# EAGLE schematic artik530_carrierboard (EAGLE 9.0.0)

## Sheet 1 of 4
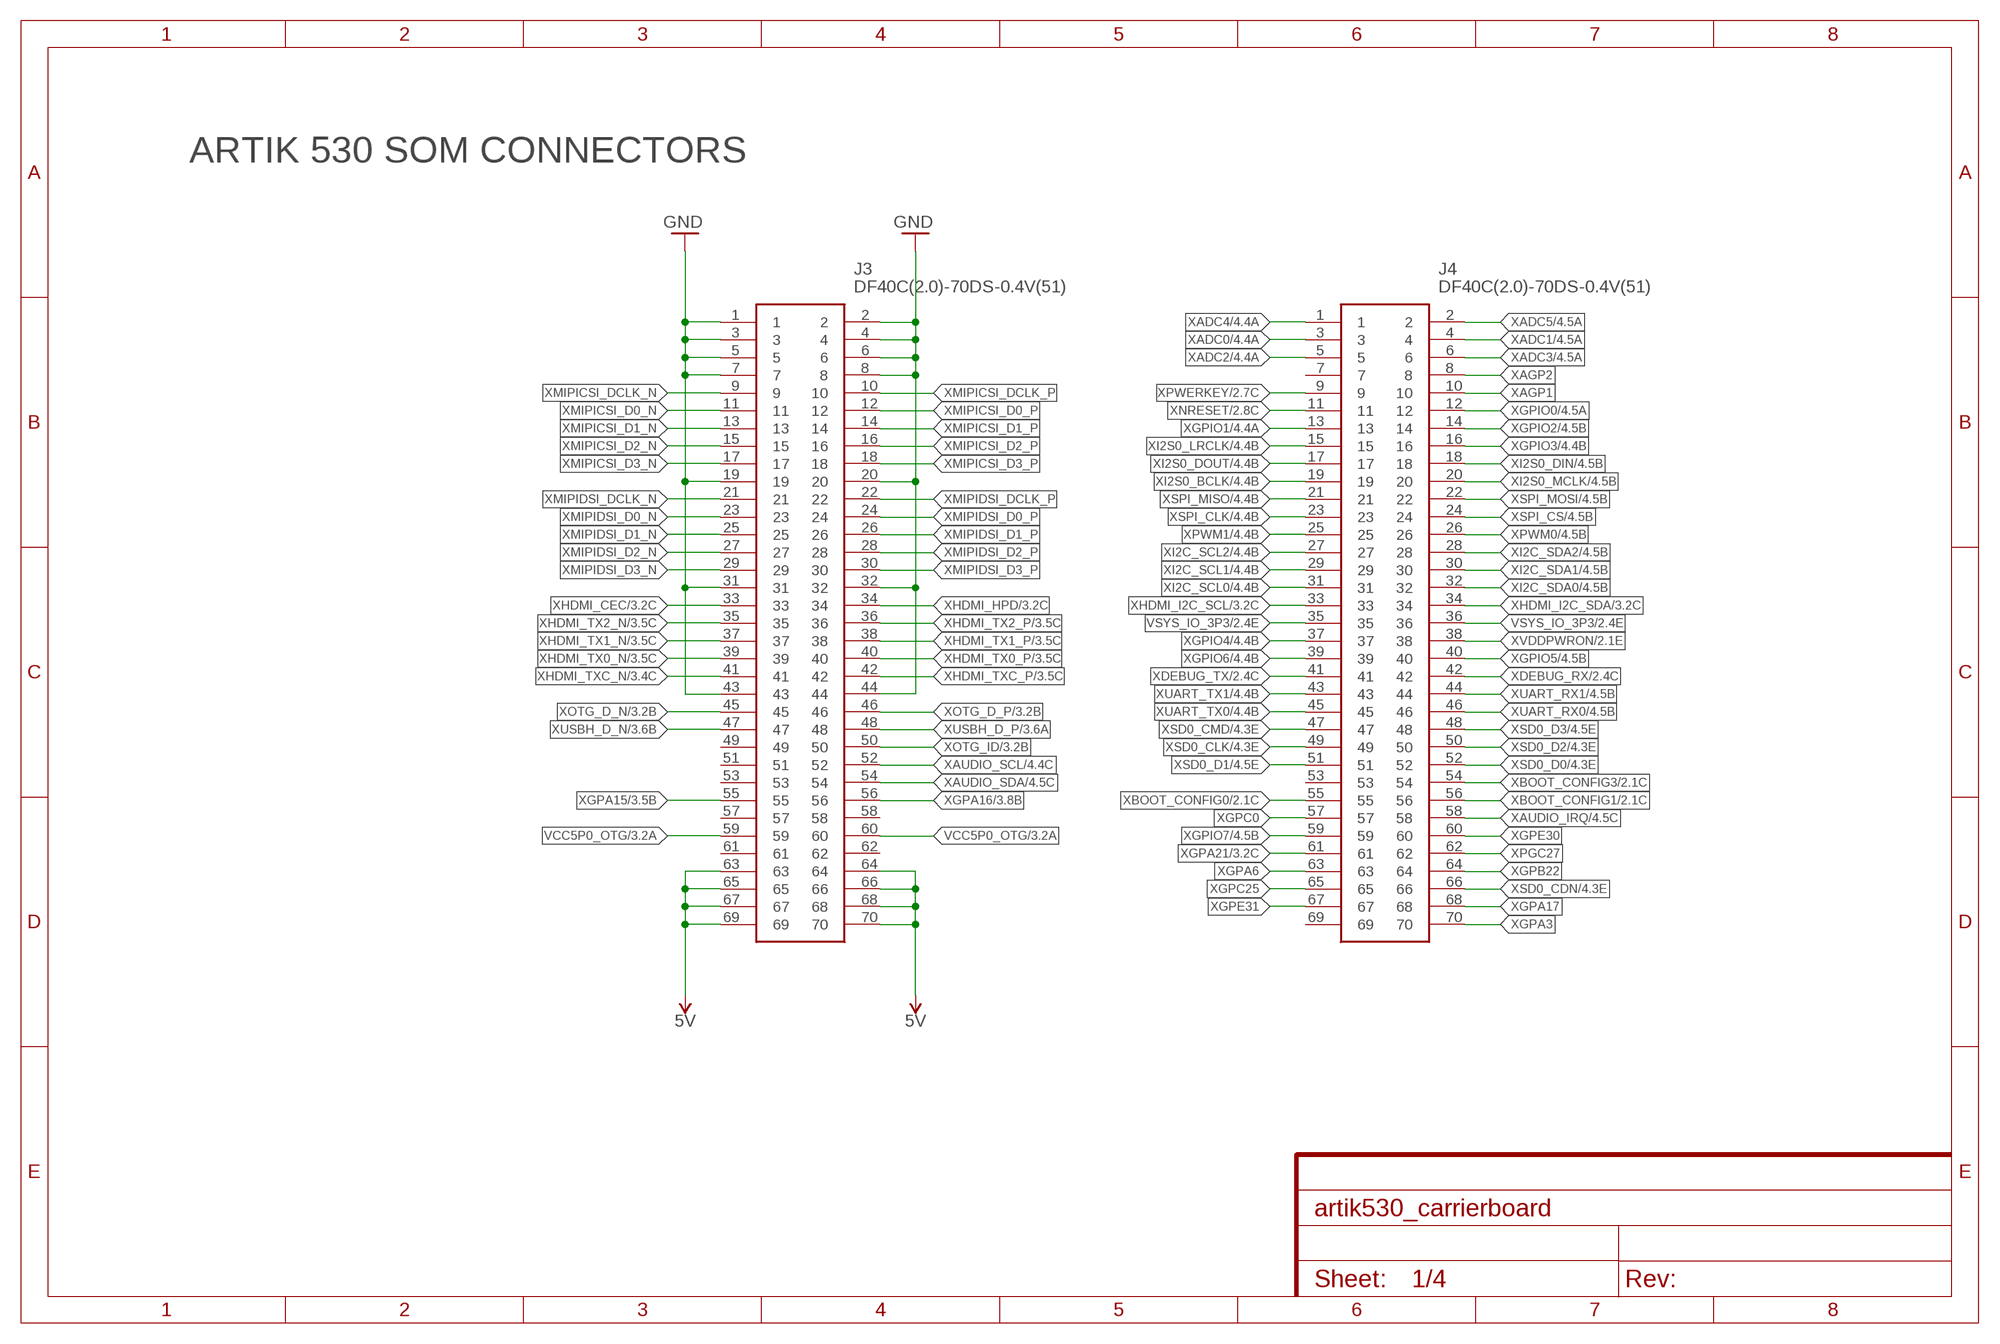
[diagram p0: schematic, sheet 1]

### Parts
J3  DF40C(2.0)-70DS-0.4V(51)  [DF40C(2.0)-70DS-0.4V(51)]
J4  DF40C(2.0)-70DS-0.4V(51)  [DF40C(2.0)-70DS-0.4V(51)]

### Nets
5V: J3.63 J3.64 J3.65 J3.66 J3.67 J3.68 J3.69 J3.70 ; also sheet 2,3,4
GND: J3.1 J3.2 J3.3 J3.4 J3.5 J3.6 J3.7 J3.8 J3.19 J3.20 J3.31 J3.32 J3.43 J3.44 ; also sheet 2,3,4
VCC5P0_OTG: J3.59 J3.60 ; also sheet 3
VSYS_IO_3P3: J4.35 J4.36 ; also sheet 2
XADC0: J4.3 ; also sheet 4
XADC1: J4.4 ; also sheet 4
XADC2: J4.5 ; also sheet 4
XADC3: J4.6 ; also sheet 4
XADC4: J4.1 ; also sheet 4
XADC5: J4.2 ; also sheet 4
XAGP1: J4.10
XAGP2: J4.8
XAUDIO_IRQ: J4.58 ; also sheet 4
XAUDIO_SCL: J3.52 ; also sheet 4
XAUDIO_SDA: J3.54 ; also sheet 4
XBOOT_CONFIG0: J4.55 ; also sheet 2
XBOOT_CONFIG1: J4.56 ; also sheet 2
XBOOT_CONFIG3: J4.54 ; also sheet 2
XDEBUG_RX: J4.42 ; also sheet 2
XDEBUG_TX: J4.41 ; also sheet 2
XGPA3: J4.70
XGPA6: J4.63
XGPA15: J3.55 ; also sheet 3
XGPA16: J3.56 ; also sheet 3
XGPA17: J4.68
XGPA21: J4.61 ; also sheet 3
XGPB22: J4.64
XGPC0: J4.57
XGPC25: J4.65
XGPE30: J4.60
XGPE31: J4.67
XGPIO0: J4.12 ; also sheet 4
XGPIO1: J4.13 ; also sheet 4
XGPIO2: J4.14 ; also sheet 4
XGPIO3: J4.16 ; also sheet 4
XGPIO4: J4.37 ; also sheet 4
XGPIO5: J4.40 ; also sheet 4
XGPIO6: J4.39 ; also sheet 4
XGPIO7: J4.59 ; also sheet 4
XHDMI_CEC: J3.33 ; also sheet 3
XHDMI_HPD: J3.34 ; also sheet 3
XHDMI_I2C_SCL: J4.33 ; also sheet 3
XHDMI_I2C_SDA: J4.34 ; also sheet 3
XHDMI_TX0_N: J3.39 ; also sheet 3
XHDMI_TX0_P: J3.40 ; also sheet 3
XHDMI_TX1_N: J3.37 ; also sheet 3
XHDMI_TX1_P: J3.38 ; also sheet 3
XHDMI_TX2_N: J3.35 ; also sheet 3
XHDMI_TX2_P: J3.36 ; also sheet 3
XHDMI_TXC_N: J3.41 ; also sheet 3
XHDMI_TXC_P: J3.42 ; also sheet 3
XI2C_SCL0: J4.31 ; also sheet 4
XI2C_SCL1: J4.29 ; also sheet 4
XI2C_SCL2: J4.27 ; also sheet 4
XI2C_SDA0: J4.32 ; also sheet 4
XI2C_SDA1: J4.30 ; also sheet 4
XI2C_SDA2: J4.28 ; also sheet 4
XI2S0_BCLK: J4.19 ; also sheet 4
XI2S0_DIN: J4.18 ; also sheet 4
XI2S0_DOUT: J4.17 ; also sheet 4
XI2S0_LRCLK: J4.15 ; also sheet 4
XI2S0_MCLK: J4.20 ; also sheet 4
XMIPICSI_D0_N: J3.11
XMIPICSI_D0_P: J3.12
XMIPICSI_D1_N: J3.13
XMIPICSI_D1_P: J3.14
XMIPICSI_D2_N: J3.15
XMIPICSI_D2_P: J3.16
XMIPICSI_D3_N: J3.17
XMIPICSI_D3_P: J3.18
XMIPICSI_DCLK_N: J3.9
XMIPICSI_DCLK_P: J3.10
XMIPIDSI_D0_N: J3.23
XMIPIDSI_D0_P: J3.24
XMIPIDSI_D1_N: J3.25
XMIPIDSI_D1_P: J3.26
XMIPIDSI_D2_N: J3.27
XMIPIDSI_D2_P: J3.28
XMIPIDSI_D3_N: J3.29
XMIPIDSI_D3_P: J3.30
XMIPIDSI_DCLK_N: J3.21
XMIPIDSI_DCLK_P: J3.22
XNRESET: J4.11 ; also sheet 2
XOTG_D_N: J3.45 ; also sheet 3
XOTG_D_P: J3.46 ; also sheet 3
XOTG_ID: J3.50 ; also sheet 3
XPGC27: J4.62
XPWERKEY: J4.9 ; also sheet 2
XPWM0: J4.26 ; also sheet 4
XPWM1: J4.25 ; also sheet 4
XSD0_CDN: J4.66 ; also sheet 4
XSD0_CLK: J4.49 ; also sheet 4
XSD0_CMD: J4.47 ; also sheet 4
XSD0_D0: J4.52 ; also sheet 4
XSD0_D1: J4.51 ; also sheet 4
XSD0_D2: J4.50 ; also sheet 4
XSD0_D3: J4.48 ; also sheet 4
XSPI_CLK: J4.23 ; also sheet 4
XSPI_CS: J4.24 ; also sheet 4
XSPI_MISO: J4.21 ; also sheet 4
XSPI_MOSI: J4.22 ; also sheet 4
XUART_RX0: J4.46 ; also sheet 4
XUART_RX1: J4.44 ; also sheet 4
XUART_TX0: J4.45 ; also sheet 4
XUART_TX1: J4.43 ; also sheet 4
XUSBH_D_N: J3.47 ; also sheet 3
XUSBH_D_P: J3.48 ; also sheet 3
XVDDPWRON: J4.38 ; also sheet 2
Unconnected: J3.49 J3.51 J3.53 J3.57 J3.58 J3.61 J3.62 J4.7 J4.53 J4.69

### Notes on the sheet
- ARTIK 530 SOM CONNECTORS

## Sheet 2 of 4
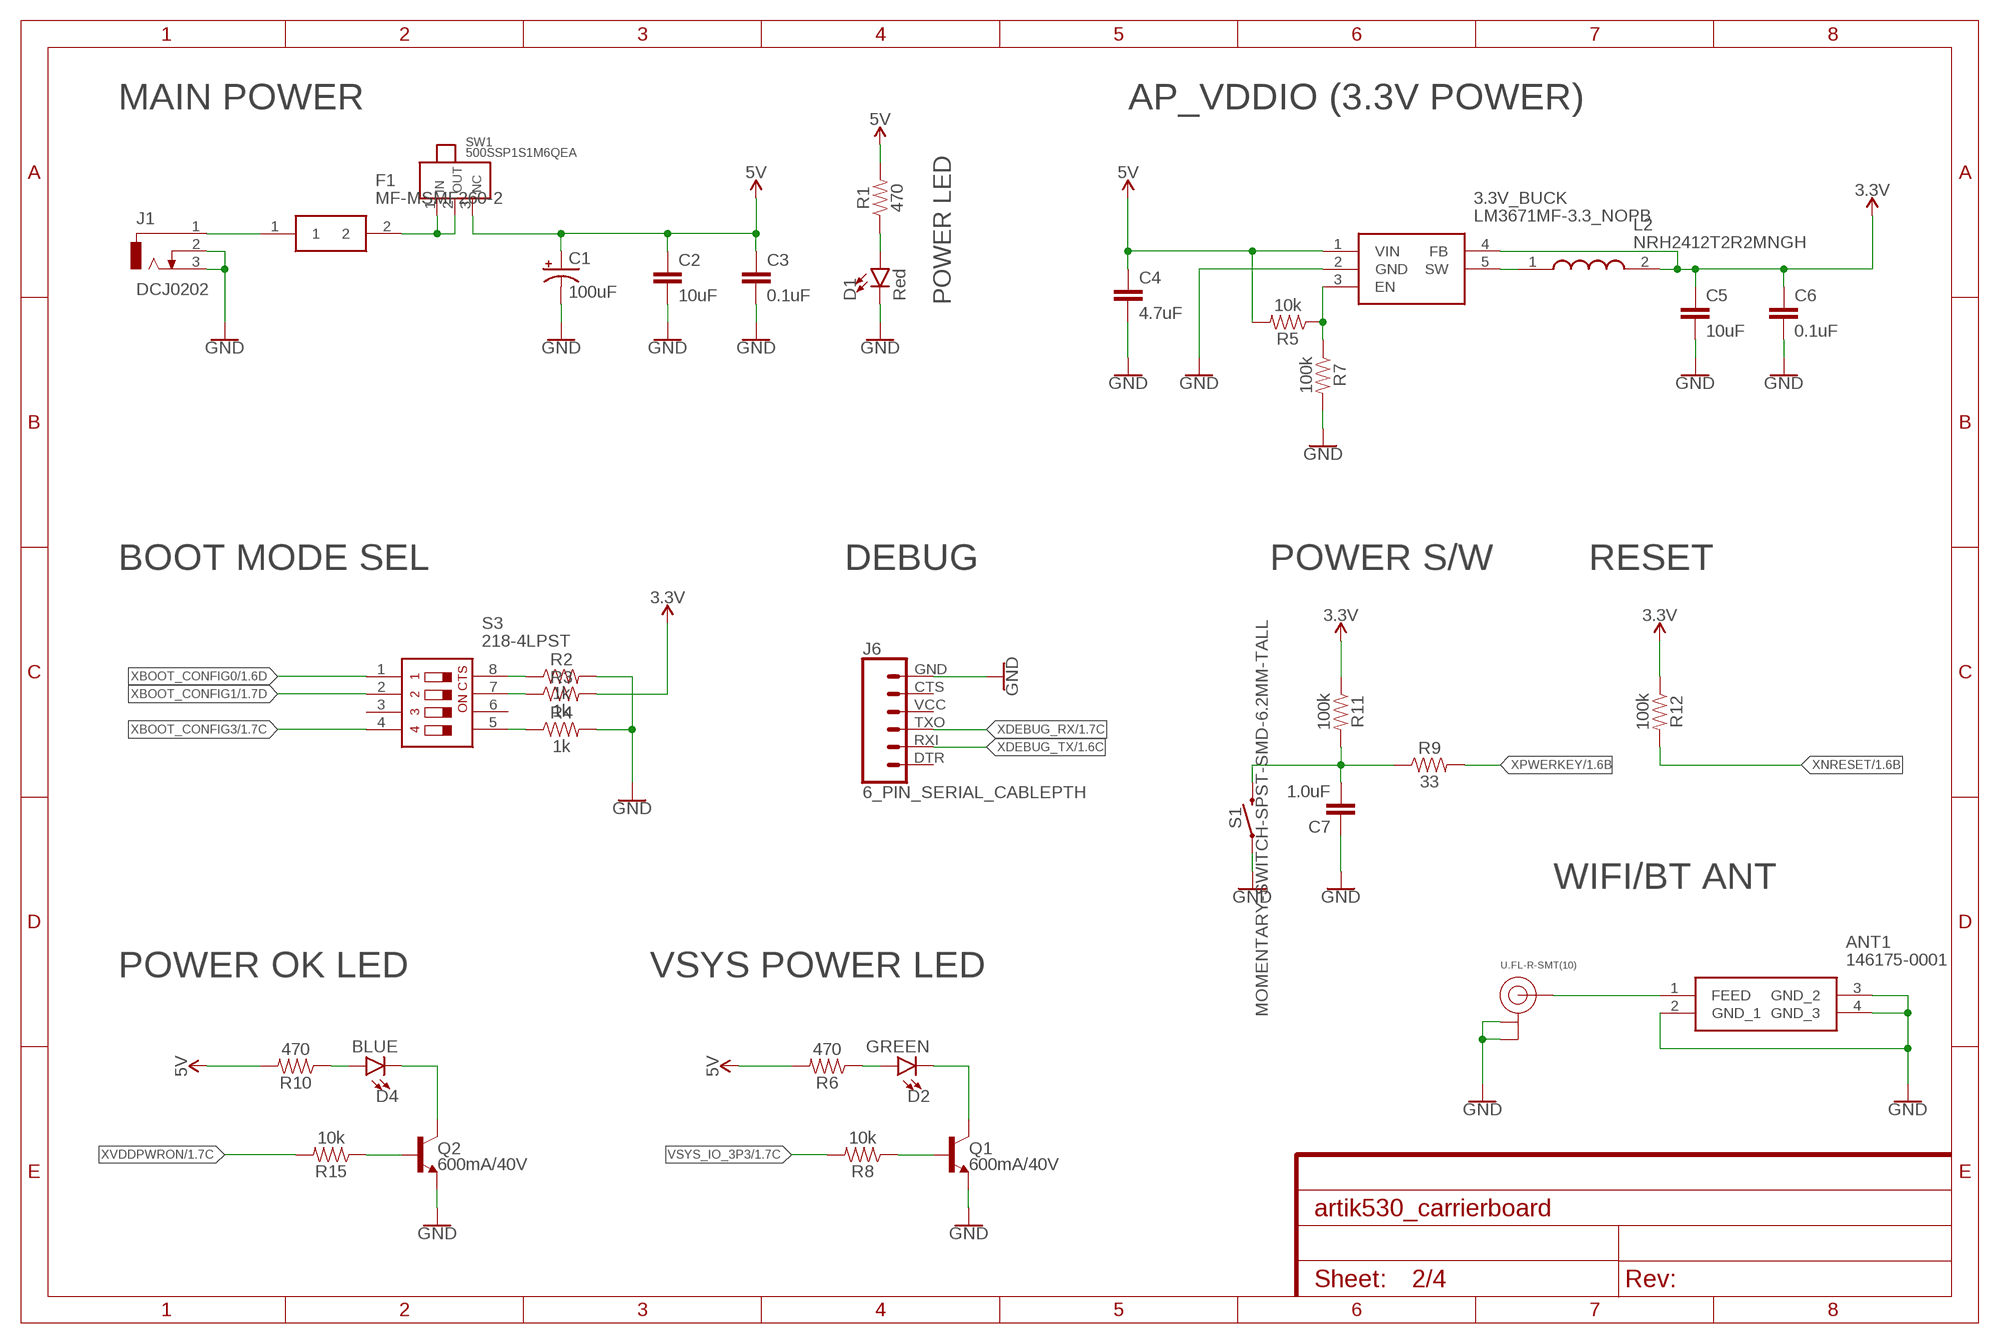
[diagram p1: schematic, sheet 2]

### Parts
3.3V_BUCK  LM3671MF-3.3_NOPB  [SOT95P284X122-5N]
ANT1  146175-0001  [146175-0001]
C1  100uF  100UF-POLAR-EIA7343-10V-10%(TANT)  [EIA7343]
C2  10uF  10UF-0603-6.3V-20%  [0603]
C3  0.1uF  0.1UF-0603-25V-(+80/-20%)  [0603]
C4  4.7uF  4.7UF-0603-6.3V-(10%)  [0603]
C5  10uF  10UF-0603-6.3V-20%  [0603]
C6  0.1uF  0.1UF-0603-25V-(+80/-20%)  [0603]
C7  1.0uF  1.0UF-0603-16V-10%  [0603]
D1  Red  LED-RED0603-SMART  [LED-0603]
D2  GREEN  LED-GREEN0603  [LED-0603]
D4  BLUE  LED-GREEN0603  [LED-0603]
F1  MF-MSMF260-2  [MF-MSMF260-2]
J1  DCJ0202  [DCJ0202]
J6  6_PIN_SERIAL_CABLEPTH  [FTDI_BASIC]
L2  NRH2412T2R2MNGH  [NRH2412T2R2MNGH]
Q1  600mA/40V  TRANS_NPN-MMBT2222AL  [SOT23-3]
Q2  600mA/40V  TRANS_NPN-MMBT2222AL  [SOT23-3]
R1  470  470OHM-0603-1/10W-1%  [0603]
R2  1k  1KOHM-0603-1/10W-1%  [0603]
R3  1k  1KOHM-0603-1/10W-1%  [0603]
R4  1k  1KOHM-0603-1/10W-1%  [0603]
R5  10k  10KOHM-0603-1/10W-1%  [0603]
R6  470  470OHM-0603-1/10W-1%  [0603]
R7  100k  100KOHM-0603-1/10W-1%  [0603]
R8  10k  10KOHM-0603-1/10W-1%  [0603]
R9  33  33OHM-0603-1/10W-1%  [0603]
R10  470  470OHM-0603-1/10W-1%  [0603]
R11  100k  100KOHM-0603-1/10W-1%  [0603]
R12  100k  100KOHM-0603-1/10W-1%  [0603]
R15  10k  10KOHM-0603-1/10W-1%  [0603]
S1  MOMENTARY-SWITCH-SPST-SMD-6.2MM-TALL  [TACTILE_SWITCH_SMD_6.2MM_TALL]
S3  218-4LPST  [SOIC127P844X265-8N]
SW1  500SSP1S1M6QEA  [500SSP1S1M6QEA]
U$3  U.FL-R-SMT(10)  [U.FL-R-SMT(10)]

### Nets
3.3V: 3.3V_BUCK.4(FB) C5.1 C6.1 L2.2 R3.2 R11.1 R12.1 ; also sheet 3,4
5V: 3.3V_BUCK.1(VIN) C1.A(+) C2.1 C3.1 C4.1 R1.2 R5.2 R6.2 R10.2 SW1.3(NC) ; also sheet 1,3,4
GND: 3.3V_BUCK.2(GND) ANT1.2(GND_1) ANT1.3(GND_2) ANT1.4(GND_3) C1.C(-) C2.2 C3.2 C4.2 C5.2 C6.2 C7.1 D1.C J1.2 J1.3 J6.GND Q1.2(E) Q2.2(E) R2.2 R4.2 R7.2 S1.A2 U$3.1(GND1) U$3.2(GND2) ; also sheet 1,3,4
N$1: F1.1 J1.1
N$2: F1.2 SW1.1(IN) SW1.2(OUT)
N$3: 3.3V_BUCK.5(SW) L2.1
N$4: D1.A R1.1
N$5: R2.1 S3.8
N$6: R3.1 S3.7
N$7: R4.1 S3.5
N$8: D2.A R6.1
N$9: 3.3V_BUCK.3(EN) R5.1 R7.1
N$10: D2.C Q1.3(C)
N$11: Q1.1(B) R8.1
N$12: C7.2 R9.1 R11.2 S1.B2
N$13: D4.A R10.1
N$20: D4.C Q2.3(C)
N$21: Q2.1(B) R15.1
N$32: ANT1.1(FEED) U$3.3(SIG)
VSYS_IO_3P3: R8.2 ; also sheet 1
XBOOT_CONFIG0: S3.1 ; also sheet 1
XBOOT_CONFIG1: S3.2 ; also sheet 1
XBOOT_CONFIG3: S3.4 ; also sheet 1
XDEBUG_RX: J6.TXO ; also sheet 1
XDEBUG_TX: J6.RXI ; also sheet 1
XNRESET: R12.2 ; also sheet 1
XPWERKEY: R9.2 ; also sheet 1
XVDDPWRON: R15.2 ; also sheet 1
Unconnected: J6.CTS J6.DTR J6.VCC S3.3 S3.6

### Notes on the sheet
- MAIN POWER | AP_VDDIO (3.3V POWER)
- POWER LED
- BOOT MODE SEL | DEBUG | POWER S/W | RESET
- WIFI/BT ANT
- POWER OK LED | VSYS POWER LED

## Sheet 3 of 4
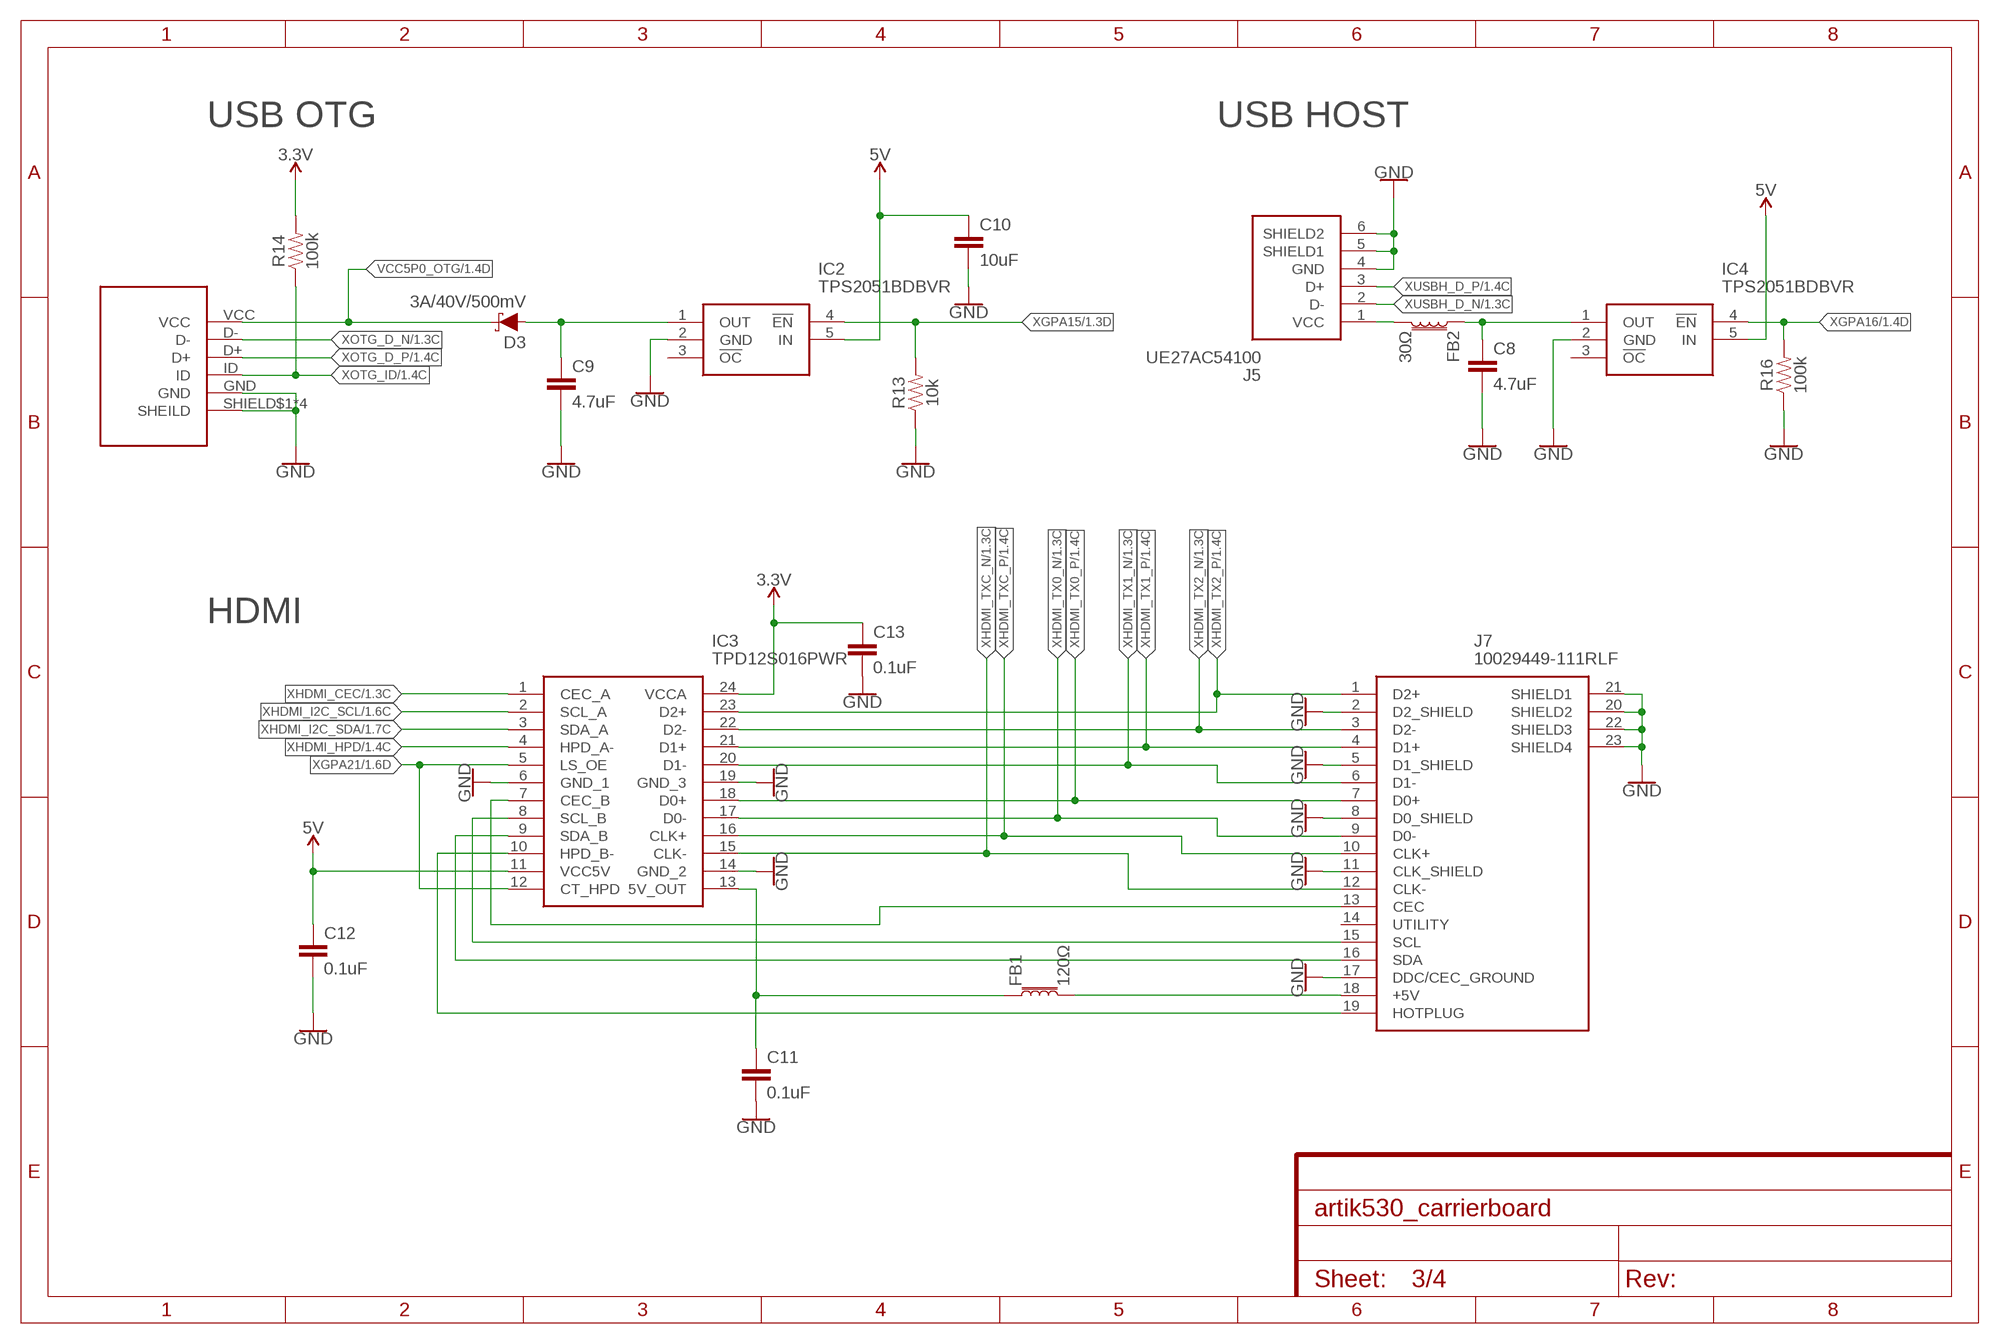
[diagram p2: schematic, sheet 3]

### Parts
C8  4.7uF  4.7UF-0603-6.3V-(10%)  [0603]
C9  4.7uF  4.7UF-0603-6.3V-(10%)  [0603]
C10  10uF  10UF-0603-6.3V-20%  [0603]
C11  0.1uF  0.1UF-0603-25V-(+80/-20%)  [0603]
C12  0.1uF  0.1UF-0603-25V-(+80/-20%)  [0603]
C13  0.1uF  0.1UF-0603-25V-(+80/-20%)  [0603]
D3  3A/40V/500mV  DIODE-SCHOTTKY-B340A  [SMA-DIODE]
FB1  120Ω  FERRITE_BEAD-0603  [0603]
FB2  30Ω  FERRITE_BEAD-0603  [0603]
IC2  TPS2051BDBVR  [SOT95P280X145-5N]
IC3  TPD12S016PWR  [SOP65P640X120-24N]
IC4  TPS2051BDBVR  [SOT95P280X145-5N]
J2  10118193-0001LF  [10118193-0001LF]
J5  UE27AC54100  [UE27AC54100]
J7  10029449-111RLF  [10029449-111RLF_1]
R13  10k  10KOHM-0603-1/10W-1%  [0603]
R14  100k  100KOHM-0603-1/10W-1%  [0603]
R16  100k  100KOHM-0603-1/10W-1%  [0603]

### Nets
3.3V: C13.1 IC3.24(VCCA) R14.2 ; also sheet 2,4
5V: C10.1 C12.1 IC2.5(IN) IC3.11(VCC5V) IC4.5(IN) ; also sheet 1,2,4
GND: C8.2 C9.2 C10.2 C11.2 C12.2 C13.2 IC2.2(GND) IC3.6(GND_1) IC3.14(GND_2) IC3.19(GND_3) IC4.2(GND) J2.GND J2.SHIELD$1(SHEILD) J2.SHIELD$2(SHEILD) J2.SHIELD$3(SHEILD) J2.SHIELD$4(SHEILD) J5.4(GND) J5.5(SHIELD1) J5.6(SHIELD2) J7.2(D2_SHIELD) J7.5(D1_SHIELD) J7.8(D0_SHIELD) J7.11(CLK_SHIELD) J7.17(DDC/CEC_GROUND) J7.20(SHIELD2) J7.21(SHIELD1) J7.22(SHIELD3) J7.23(SHIELD4) R13.1 R16.1 ; also sheet 1,2,4
N$14: C11.1 FB1.1 IC3.13(5V_OUT)
N$15: C9.1 D3.A IC2.1(OUT)
N$16: IC3.7(CEC_B) J7.13(CEC)
N$17: IC3.8(SCL_B) J7.15(SCL)
N$18: IC3.9(SDA_B) J7.16(SDA)
N$19: IC3.10(HPD_B-) J7.19(HOTPLUG)
N$22: FB1.2 J7.18(+5V)
N$23: C8.1 FB2.1 IC4.1(OUT)
N$24: FB2.2 J5.1(VCC)
VCC5P0_OTG: D3.C J2.VCC ; also sheet 1
XGPA15: IC2.4(!EN) R13.2 ; also sheet 1
XGPA16: IC4.4(!EN) R16.2 ; also sheet 1
XGPA21: IC3.5(LS_OE) IC3.12(CT_HPD) ; also sheet 1
XHDMI_CEC: IC3.1(CEC_A) ; also sheet 1
XHDMI_HPD: IC3.4(HPD_A-) ; also sheet 1
XHDMI_I2C_SCL: IC3.2(SCL_A) ; also sheet 1
XHDMI_I2C_SDA: IC3.3(SDA_A) ; also sheet 1
XHDMI_TX0_N: IC3.17(D0-) J7.9(D0-) ; also sheet 1
XHDMI_TX0_P: IC3.18(D0+) J7.7(D0+) ; also sheet 1
XHDMI_TX1_N: IC3.20(D1-) J7.6(D1-) ; also sheet 1
XHDMI_TX1_P: IC3.21(D1+) J7.4(D1+) ; also sheet 1
XHDMI_TX2_N: IC3.22(D2-) J7.3(D2-) ; also sheet 1
XHDMI_TX2_P: IC3.23(D2+) J7.1(D2+) ; also sheet 1
XHDMI_TXC_N: IC3.15(CLK-) J7.12(CLK-) ; also sheet 1
XHDMI_TXC_P: IC3.16(CLK+) J7.10(CLK+) ; also sheet 1
XOTG_D_N: J2.D- ; also sheet 1
XOTG_D_P: J2.D+ ; also sheet 1
XOTG_ID: J2.ID R14.1 ; also sheet 1
XUSBH_D_N: J5.2(D-) ; also sheet 1
XUSBH_D_P: J5.3(D+) ; also sheet 1
Unconnected: IC2.3(!OC) IC4.3(!OC) J7.14(UTILITY)

### Notes on the sheet
- USB OTG | USB HOST
- HDMI

## Sheet 4 of 4
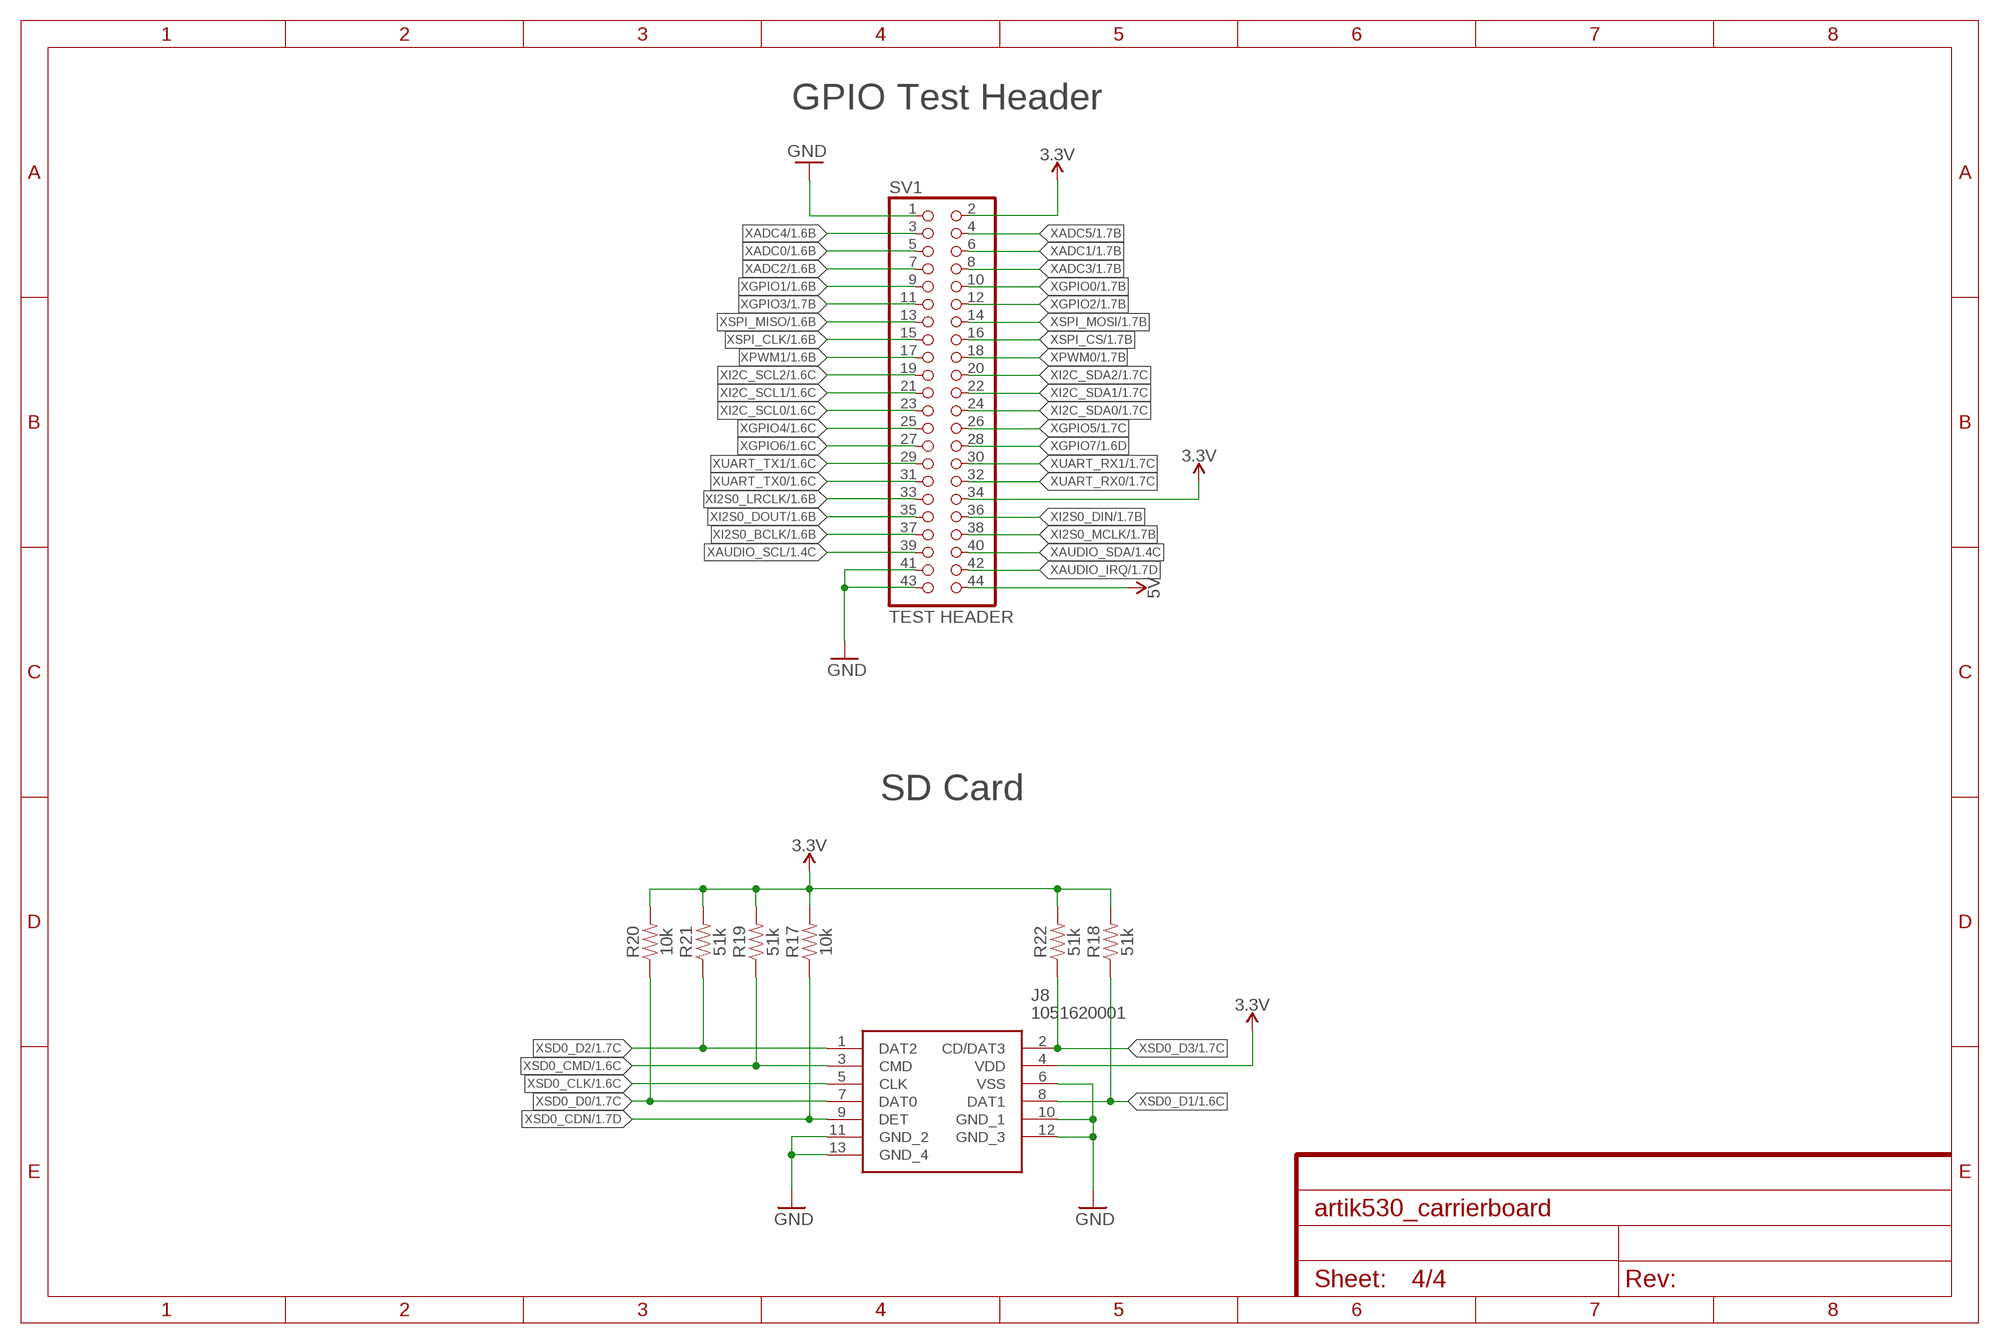
[diagram p3: schematic, sheet 4]

### Parts
J8  1051620001  [1051620001]
R17  10k  10KOHM-0603-1/10W-1%  [0603]
R18  51k  10KOHM-0603-1/10W-1%  [0603]
R19  51k  10KOHM-0603-1/10W-1%  [0603]
R20  10k  10KOHM-0603-1/10W-1%  [0603]
R21  51k  10KOHM-0603-1/10W-1%  [0603]
R22  51k  10KOHM-0603-1/10W-1%  [0603]
SV1  TEST HEADER  PINHD-2X22  [2X22]

### Nets
3.3V: J8.4(VDD) R17.2 R18.2 R19.2 R20.2 R21.2 R22.2 SV1.2 SV1.34 ; also sheet 2,3
5V: SV1.44 ; also sheet 1,2,3
GND: J8.6(VSS) J8.10(GND_1) J8.11(GND_2) J8.12(GND_3) J8.13(GND_4) SV1.1 SV1.41 SV1.43 ; also sheet 1,2,3
XADC0: SV1.5 ; also sheet 1
XADC1: SV1.6 ; also sheet 1
XADC2: SV1.7 ; also sheet 1
XADC3: SV1.8 ; also sheet 1
XADC4: SV1.3 ; also sheet 1
XADC5: SV1.4 ; also sheet 1
XAUDIO_IRQ: SV1.42 ; also sheet 1
XAUDIO_SCL: SV1.39 ; also sheet 1
XAUDIO_SDA: SV1.40 ; also sheet 1
XGPIO0: SV1.10 ; also sheet 1
XGPIO1: SV1.9 ; also sheet 1
XGPIO2: SV1.12 ; also sheet 1
XGPIO3: SV1.11 ; also sheet 1
XGPIO4: SV1.25 ; also sheet 1
XGPIO5: SV1.26 ; also sheet 1
XGPIO6: SV1.27 ; also sheet 1
XGPIO7: SV1.28 ; also sheet 1
XI2C_SCL0: SV1.23 ; also sheet 1
XI2C_SCL1: SV1.21 ; also sheet 1
XI2C_SCL2: SV1.19 ; also sheet 1
XI2C_SDA0: SV1.24 ; also sheet 1
XI2C_SDA1: SV1.22 ; also sheet 1
XI2C_SDA2: SV1.20 ; also sheet 1
XI2S0_BCLK: SV1.37 ; also sheet 1
XI2S0_DIN: SV1.36 ; also sheet 1
XI2S0_DOUT: SV1.35 ; also sheet 1
XI2S0_LRCLK: SV1.33 ; also sheet 1
XI2S0_MCLK: SV1.38 ; also sheet 1
XPWM0: SV1.18 ; also sheet 1
XPWM1: SV1.17 ; also sheet 1
XSD0_CDN: J8.9(DET) R17.1 ; also sheet 1
XSD0_CLK: J8.5(CLK) ; also sheet 1
XSD0_CMD: J8.3(CMD) R19.1 ; also sheet 1
XSD0_D0: J8.7(DAT0) R20.1 ; also sheet 1
XSD0_D1: J8.8(DAT1) R18.1 ; also sheet 1
XSD0_D2: J8.1(DAT2) R21.1 ; also sheet 1
XSD0_D3: J8.2(CD/DAT3) R22.1 ; also sheet 1
XSPI_CLK: SV1.15 ; also sheet 1
XSPI_CS: SV1.16 ; also sheet 1
XSPI_MISO: SV1.13 ; also sheet 1
XSPI_MOSI: SV1.14 ; also sheet 1
XUART_RX0: SV1.32 ; also sheet 1
XUART_RX1: SV1.30 ; also sheet 1
XUART_TX0: SV1.31 ; also sheet 1
XUART_TX1: SV1.29 ; also sheet 1

### Notes on the sheet
- GPIO Test Header
- SD Card

## Library data of the parts
3.3V_BUCK = LM3671MF-3.3_NOPB:LM3671MF-3.3_NOPB: DC-DC Converter Step-Dn 2.7-5.5V SOT23-5 Texas Instruments LM3671MF-3.3/NOPB, Step Down DC-DC Converter, 600mA, Adjustable, 1.1 3.3 V, 5-Pin SOT-23 Source: Datasheet <http://www.ti.com/lit/ds/symlink/lm3671.pdf>; DESCRIPTION: DC-DC Converter Step-Dn 2.7-5.5V SOT23-5 Texas Instruments LM3671MF-3.3/NOPB, Step Down DC-DC Converter, 600mA, Adjustable, 1.1 3.3 V, 5-Pin SOT-23; DIGIKEY_PART_NUMBER: LM3671MF-3.3/NOPBTR-ND; HEIGHT: 1.22mm; MANUFACTURER_NAME: Texas Instruments; MANUFACTURER_PART_NUMBER: LM3671MF-3.3/NOPB
ANT1 = 146175-0001:146175-0001: Antennas 2.4/5GHz SMTOnGround MID Chip Antenna Source: Datasheet <http://www.molex.com/webdocs/datasheets/pdf/en-us/1461750001_ANTENNAS.pdf>; ALLIED_NUMBER: 70904228; ALLIED_PRICE-STOCK: https://www.alliedelec.com/molex-incorporated-146175-0001/70904228/; ARROW_PART_NUMBER: 146175-0001; DESCRIPTION: Antennas 2.4/5GHz SMTOnGround MID Chip Antenna; HEIGHT: mm; MANUFACTURER_NAME: Molex; MANUFACTURER_PART_NUMBER: 146175-0001
C1 = SparkFun-Capacitors:100UF-POLAR: 100µF polarized capacitors A capacitor is a passive two-terminal electrical component used to store electrical energy temporarily in an electric field.; PROD_ID: CAP-07890
C2 C5 C10 = SparkFun-Capacitors:10UF: 10.0µF ceramic capacitors A capacitor is a passive two-terminal electrical component used to store electrical energy temporarily in an electric field.; PROD_ID: CAP-11015
C3 C6 C11-C13 = SparkFun-Capacitors:0.1UF: 0.1µF ceramic capacitors A capacitor is a passive two-terminal electrical component used to store electrical energy temporarily in an electric field.; PROD_ID: CAP-00810
C4 C8 C9 = SparkFun-Capacitors:4.7UF: 4.7µF ceramic capacitors A capacitor is a passive two-terminal electrical component used to store electrical energy temporarily in an electric field.; PROD_ID: CAP-08280
C7 = SparkFun-Capacitors:1.0UF: 1µF ceramic capacitors A capacitor is a passive two-terminal electrical component used to store electrical energy temporarily in an electric field.; PROD_ID: CAP-00868
D1 = SparkFun-LED:LED-RED: Red SMD LED Used in manufacturing of most products at SparkFun Packages: 0603 - SMD 0603 package [Product Link] <http://docs.avagotech.com/docs/AV02-0551EN> 0603 SMART - SMD 0603 SMART package ( more efficient and expensive)[Product Link] <http://www.osram-os.com/Graphics/XPic2/00077099_0.pdf> 1206 - SMD1206 package [Product Link] <https://www.sparkfun.com/datasheets/DevTools/LilyPad/Q150OVS4.pdff> SparkFun Products: Pro Mini 328 -5V <https://www.sparkfun.com/products/821> RedBoard <https://www.sparkfun.com/products/12757> IOIO-OTG <https://www.sparkfun.com/products/13613>; PROD_ID: DIO-11154
D2 = SparkFun-LED:LED-GREEN: Green SMD LED Used in manufacturing of various products at SparkFun Packages: 0603 - SMD 0603 package [Product Link] <http://www.futureelectronics.com/en/technologies/semiconductors/optoelectronics/leds/Pages/9894312-LTST-C190GKT.aspx?CrossPart=HSMG-C190&IM=0> LilyPad 1206 - SMD1206 LilyPad package [Product Link] <http://www.futureelectronics.com/en/Technologies/Product.aspx?ProductID=IN150NGHARVATEKCORPORATION2049943&IM=0> 1206 - SMD1206 package [Product Link] <http://www.futureelectronics.com/en/technologies/semiconductors/optoelectronics/leds/Pages/8315665-LTST-C150KGKT.aspx?IM=0> 1206 Bottom Mount -SMD 1206 Bottom Mount [Product Link] <http://www.digikey.com/product-detail/en/lite-on-inc/LTST-C230KGKT/160-1456-1-ND/386854> SparkFun Products: Pro Mini 328 -5V <https://www.sparkfun.com/products/821> RedBoard <https://www.sparkfun.com/products/12757> MP3 Trigger <https://www.sparkfun.com/products/13720> Makey Makey <https://www.sparkfun.com/products/11076>; PROD_ID: DIO-00821
D3 = SparkFun-DiscreteSemi:DIODE-SCHOTTKY: Schottky diode A Schottky diode is a semiconductor diode which has a low forward voltage drop and a very fast switching action.; PROD_ID: DIO-09886
D4 = SparkFun-LED:LED-GREEN: Green SMD LED Used in manufacturing of various products at SparkFun Packages: 0603 - SMD 0603 package [Product Link] <http://www.futureelectronics.com/en/technologies/semiconductors/optoelectronics/leds/Pages/9894312-LTST-C190GKT.aspx?CrossPart=HSMG-C190&IM=0> LilyPad 1206 - SMD1206 LilyPad package [Product Link] <http://www.futureelectronics.com/en/Technologies/Product.aspx?ProductID=IN150NGHARVATEKCORPORATION2049943&IM=0> 1206 - SMD1206 package [Product Link] <http://www.futureelectronics.com/en/technologies/semiconductors/optoelectronics/leds/Pages/8315665-LTST-C150KGKT.aspx?IM=0> 1206 Bottom Mount -SMD 1206 Bottom Mount [Product Link] <http://www.digikey.com/product-detail/en/lite-on-inc/LTST-C230KGKT/160-1456-1-ND/386854> SparkFun Products: Pro Mini 328 -5V <https://www.sparkfun.com/products/821> RedBoard <https://www.sparkfun.com/products/12757> MP3 Trigger <https://www.sparkfun.com/products/13720> Makey Makey <https://www.sparkfun.com/products/11076>; PROD_ID: DIO-00821; VALUE: GREEN
F1 = MF-MSMF260-2:MF-MSMF260-2: Fuse, PTC, Resettable, SMD, 1812, 2.6A Bourns 2.6A Surface Mount Resettable Fuse, 6 V Source: Datasheet <http://uk.rs-online.com/web/p/products/6478257>; ALLIED_NUMBER: 70153472; ALLIED_PRICE-STOCK: http://www.alliedelec.com/bourns-mf-msmf260-2/70153472/; ARROW_PART_NUMBER: MF-MSMF260-2; ARROW_PRICE-STOCK: https://www.arrow.com/en/products/mf-msmf260-2/bourns; DESCRIPTION: Fuse, PTC, Resettable, SMD, 1812, 2.6A Bourns 2.6A Surface Mount Resettable Fuse, 6 V; HEIGHT: mm; MANUFACTURER_NAME: Bourns; MANUFACTURER_PART_NUMBER: MF-MSMF260-2; RS_PART_NUMBER: 6478257P; RS_PRICE-STOCK: http://uk.rs-online.com/web/p/products/6478257P
FB1 FB2 = SparkFun-Coils:FERRITE_BEAD: Ferrite Bead (blocks, cores, rings, chokes, etc.) Inductor with layers of ferrite used to suppress high frequencies. Often used to isolate high frequency noise. SparkFun Products: IOIO-OTG - V2.2 <https://www.sparkfun.com/products/13613> SparkFun SAMD21 Mini Breakout <https://www.sparkfun.com/products/13664> SparkFun 6 Degrees of Freedom Breakout - LSM6DS3 <https://www.sparkfun.com/products/13339> SparkFun SAMD21 Dev Breakout <https://www.sparkfun.com/products/13672>; PROD_ID: NDUC-13805; VALUE: 30Ω/1.8A
IC2 IC4 = TPS2051BDBVR:TPS2051BDBVR: TEXAS INSTRUMENTS - TPS2051BDBVR - CURRENT LIMITED POWER SWITCH, 5.5V SOT23-5, FULL REEL Source: Datasheet <http://www.ti.com/lit/ds/symlink/tps2051b.pdf>; ARROW_PART_NUMBER: TPS2051BDBVR; ARROW_PRICE/STOCK: https://www.arrow.com/en/products/tps2051bdbvr/texas-instruments; DESCRIPTION: TEXAS INSTRUMENTS - TPS2051BDBVR - CURRENT LIMITED POWER SWITCH, 5.5V SOT23-5, FULL REEL; HEIGHT: 1.45mm; MANUFACTURER_NAME: Texas Instruments; MANUFACTURER_PART_NUMBER: TPS2051BDBVR
IC3 = TPD12S016PWR:TPD12S016PWR: Texas Instruments,TPD12S016PWR,IC,HDMI TPD12S016PWR, HDMI Interface 12-channel HDMI 4.5 Source: Datasheet <http://www.ti.com/lit/ds/symlink/tpd12s016.pdf>; ARROW_PART_NUMBER: TPD12S016PWR; ARROW_PRICE/STOCK: https://www.arrow.com/en/products/tpd12s016pwr/texas-instruments; DESCRIPTION: Texas Instruments,TPD12S016PWR,IC,HDMI TPD12S016PWR, HDMI Interface 12-channel HDMI 4.5; HEIGHT: 1.2mm; MANUFACTURER_NAME: Texas Instruments; MANUFACTURER_PART_NUMBER: TPD12S016PWR; RS_PART_NUMBER: 1627865; RS_PRICE/STOCK: http://uk.rs-online.com/web/p/products/1627865
J1 = con-jack:DCJ0202: DC POWER JACK Source: DCJ0202.pdf; OC_FARNELL: unknown; OC_NEWARK: unknown
J2 = 10118193-0001LF:10118193-0001LF
J3 J4 = DF40C(2.0)-70DS-0.4V(51):DF40C(2.0)-70DS-0.4V(51): HIROSE(HRS) - DF40C(2.0)-70DS-0.4V(51) - CONNECTOR, STACKING, RCPT, 70POS, 2ROW Source: Datasheet <https://www.hirose.co.jp/cataloge_hp/ed_DF40_20140305.pdf>; ARROW_PART_NUMBER: DF40C(2.0)-70DS-0.4V(51); ARROW_PRICE/STOCK: https://www.arrow.com/en/products/df40c-2.0-70ds-0.4v-51/hirose-electric; DESCRIPTION: HIROSE(HRS) - DF40C(2.0)-70DS-0.4V(51) - CONNECTOR, STACKING, RCPT, 70POS, 2ROW; HEIGHT: mm; MANUFACTURER_NAME: Hirose; MANUFACTURER_PART_NUMBER: DF40C(2.0)-70DS-0.4V(51)
J5 = UE27AC54100:UE27AC54100: AMPHENOL COMMERCIAL PRODUCTS - UE27AC54100 - USB, 2.0 TYPE A, RECEPTACLE, TH Source: Datasheet <https://www.amphenolcanada.com/ProductSearch/drawings/AC/UE27ACX4X0X.pdf>; ARROW_PART_NUMBER: UE27AC54100; DESCRIPTION: AMPHENOL COMMERCIAL PRODUCTS - UE27AC54100 - USB, 2.0 TYPE A, RECEPTACLE, TH; HEIGHT: mm; MANUFACTURER_NAME: AMPHENOL COMMERCIAL PRODUCTS; MANUFACTURER_PART_NUMBER: UE27AC54100
J6 = SparkFun-Connectors:6_PIN_SERIAL_CABLE: 6-pin header connection for use with the "FTDI BASIC" pinout - CABLE SIDE. Also known as "Arduino Serial Program Header". This is used on a design to provide a 6-pin connection point for serial communication usually from a USB cable (D+/D-) to these headers (RX/TX). It also has the remaining pins necessary for programming in the Arduino evironment (DTR, GND, and sometimes VCC). Note, this device has "CABLE" in the name. It is intended to be used on a design that usually lives on the end of your USB cable and prvides the converter chip (FTDI232 or FTDI231x) to commnicate serial RX/TX. The "sister" device, named "TARGET" is inteneded to be used on a design that contains a target micro-controller that you wish to program. You can populate with some of these: Female Headers <https://www.sparkfun.com/products/115> (PRT-00115) For reference (or to suit your programming needs) check out these designs: SparkFun FTDI Basic Breakout - 5V <https://www.sparkfun.com/products/9716> (DEV-09716) SparkFun FTDI Basic Breakout - 3.3V <https://www.sparkfun.com/products/9873> (DEV-09873) SparkFun FTDI SmartBasic <https://www.sparkfun.com/products/12935> (DEV-12935) SparkFun Beefy 3 - FTDI Basic Breakout <https://www.sparkfun.com/products/13746> (DEV-13746)
J7 = 10029449-111RLF:10029449-111RLF: HDMI, Displayport & DVI Connectors HDMI Source: Datasheet <http://www.mouser.com/ds/2/18/gs-12-309-943096.pdf>; ARROW_PART_NUMBER: 10029449-111RLF; ARROW_PRICE-STOCK: https://www.arrow.com/en/products/10029449-111rlf/amphenol-fci; DESCRIPTION: HDMI, Displayport & DVI Connectors HDMI; HEIGHT: mm; MANUFACTURER_NAME: FCI; MANUFACTURER_PART_NUMBER: 10029449-111RLF
J8 = 1051620001:1051620001: 1.45H MICRO SD HEADER WITH D/C P Source: Datasheet <https://www.molex.com/pdm_docs/sd/1051620001_sd.pdf>; DESCRIPTION: 1.45H MICRO SD HEADER WITH D/C P; HEIGHT: mm; MANUFACTURER_NAME: Molex; MANUFACTURER_PART_NUMBER: 1051620001
L2 = NRH2412T2R2MNGH:NRH2412T2R2MNGH: TAIYO YUDEN - NRH2412T2R2MNGH - INDUCTOR, WIREWOUND, 2.2UH, 1A Source: Datasheet <http://ds.yuden.co.jp/TYCOMPAS/ut/detail.do?productNo=NRH2412T2R2MNGH&fileName=NRH2412T2R2MNGH_SS&mode=specSheetDownload>; ARROW_PART_NUMBER: NRH2412T2R2MNGH; ARROW_PRICE-STOCK: https://www.arrow.com/en/products/nrh2412t2r2mngh/taiyo-yuden; DESCRIPTION: TAIYO YUDEN - NRH2412T2R2MNGH - INDUCTOR, WIREWOUND, 2.2UH, 1A; HEIGHT: 1mm; MANUFACTURER_NAME: TAIYO YUDEN; MANUFACTURER_PART_NUMBER: NRH2412T2R2MNGH
Q1 Q2 = SparkFun-DiscreteSemi:TRANS_NPN: NPN transistor Current controlled devices typically used to amplify current or used as a switch. BC547 - COM-08928 <http://www.sparkfun.com/products/8928> (TO-92 45V 100mA) (1.Collector 2.Base 3.Emitter) 2N3904 - COM-00521 <http://www.sparkfun.com/products/521> (TO-92 40V 200mA) (1.Emitter 2.Base 3.Collector) P2N2222A - COM-12852 <http://www.sparkfun.com/products/12852> (TO-92 40V 600mA) (1.Collector 2.Base 3.Emitter); PROD_ID: TRANS-08049
R1 R6 R10 = SparkFun-Resistors:470OHM: 470Ω resistor A resistor is a passive two-terminal electrical component that implements electrical resistance as a circuit element. Resistors act to reduce current flow, and, at the same time, act to lower voltage levels within circuits. - Wikipedia; PROD_ID: RES-07869
R2-R4 = SparkFun-Resistors:1KOHM: 1kΩ resistor A resistor is a passive two-terminal electrical component that implements electrical resistance as a circuit element. Resistors act to reduce current flow, and, at the same time, act to lower voltage levels within circuits. - Wikipedia; PROD_ID: RES-07856
R5 R8 R13 R15 R17 R20 = SparkFun-Resistors:10KOHM: 10kΩ resistor A resistor is a passive two-terminal electrical component that implements electrical resistance as a circuit element. Resistors act to reduce current flow, and, at the same time, act to lower voltage levels within circuits. - Wikipedia; PROD_ID: RES-00824
R7 R11 R12 R14 R16 = SparkFun-Resistors:100KOHM: 100kΩ resistor A resistor is a passive two-terminal electrical component that implements electrical resistance as a circuit element. Resistors act to reduce current flow, and, at the same time, act to lower voltage levels within circuits. - Wikipedia; PROD_ID: RES-07828
R9 = SparkFun-Resistors:33OHM: 33Ω resistor A resistor is a passive two-terminal electrical component that implements electrical resistance as a circuit element. Resistors act to reduce current flow, and, at the same time, act to lower voltage levels within circuits. - Wikipedia; PROD_ID: RES-08270
R18 R19 R21 R22 = SparkFun-Resistors:10KOHM: 10kΩ resistor A resistor is a passive two-terminal electrical component that implements electrical resistance as a circuit element. Resistors act to reduce current flow, and, at the same time, act to lower voltage levels within circuits. - Wikipedia; PROD_ID: RES-00824; VALUE: 10k
S1 = SparkFun-Switches:MOMENTARY-SWITCH-SPST: Momentary Switch (Pushbutton) - SPST Normally-open (NO) SPST momentary switches (buttons, pushbuttons). Variants PTH-12MM - 12mm square, through-hole Momentary Pushbutton Switch - 12mm Square <https://www.sparkfun.com/products/9190> (COM-09190) PTH-6.0MM, PTH-6.0MM-KIT - 6.0mm square, through-hole Mini Pushbutton Switch <https://www.sparkfun.com/products/97> (COM-00097) KIT package intended for soldering kit's - only one side of pads' copper is exposed. PTH-RIGHT-ANGLE-KIT - Right-angle, through-hole Right Angle Tactile Button <https://www.sparkfun.com/products/10791> - Used on SparkFun BigTime Watch Kit <https://www.sparkfun.com/products/11734> SMD-12MM - 12mm square, surface-mount Tactile Button - SMD (12mm) <https://www.sparkfun.com/products/12993> (COM-12993) Used on SparkFun PicoBoard <https://www.sparkfun.com/products/11888> SMD-4.5MM - 4.5mm Square Trackball Switch Used on SparkFun Blackberry Trackballer Breakout <https://www.sparkfun.com/products/13169> SMD-4.6MMX2.8MM - 4.60mm x 2.80mm, surface mount Used on SparkFun SAMD21 Mini Breakout <https://www.sparkfun.com/products/13664> SMD-5.2MM, SMD-5.2-REDUNDANT - 5.2mm square, surface-mount Mini Pushbutton Switch - SMD <https://www.sparkfun.com/products/8720> (COM-08720) Used on Arduino Pro Mini <https://www.sparkfun.com/products/11114> REDUNDANT package connects both switch circuits together SMD-6.0X3.5MM - 6.0 x 3.5mm, surface mount Momentary Reset Switch SMD <https://www.sparkfun.com/products/8229> (COM-08229) SMD-6.2MM-TALL - 6.2mm square, surface mount Tactile Button - SMD (6mm) <https://www.sparkfun.com/products/12992> Used on SparkFun Digital Sandbox <https://www.sparkfun.com/products/12651> SMD-RIGHT-ANGLE - Right-angle, surface mount Used on SparkFun Block for Intel® Edison - Arduino <https://www.sparkfun.com/products/13036>; PROD_ID: SWCH-11966; SF_SKU: COM-12992
S3 = 218-4LPST:218-4LPST: Half Pitch, SMD DIP Switch Source: Datasheet <https://www.ctscorp.com/wp-content/uploads/218.pdf>; ARROW_PART_NUMBER: 218-4LPST; ARROW_PRICE/STOCK: https://www.arrow.com/en/products/218-4lpst/cts; DESCRIPTION: Half Pitch, SMD DIP Switch; HEIGHT: 2.65mm; MANUFACTURER_NAME: CTS; MANUFACTURER_PART_NUMBER: 218-4LPST
SV1 = pinhead:PINHD-2X22: PIN HEADER
SW1 = ARTIK530_EAGLE_LIB:500SSP1S1M6QEA
U$3 = ARTIK530_EAGLE_LIB:U.FL-R-SMT(10)

## Net classes
1 differential: width 0.127 mm, drill 0.3 mm, clearance 0.127 mm